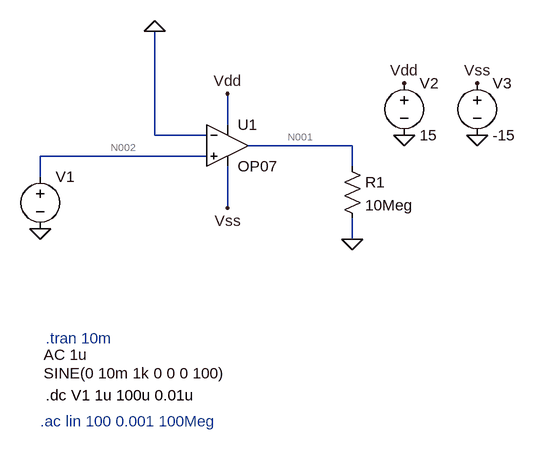
[diagram p0: schematic 1c.asc]
1c.asc, the LTspice schematic file:
Version 4.1
SHEET 1 880 680
WIRE 160 112 160 64
WIRE 48 128 48 -32
WIRE 128 128 48 128
WIRE 352 144 192 144
WIRE 128 160 -128 160
WIRE 352 176 352 144
WIRE -128 192 -128 160
WIRE 160 240 160 176
WIRE 352 288 352 256
FLAG -128 272 0
FLAG 432 128 0
FLAG 544 128 0
FLAG 432 48 Vdd
FLAG 544 48 Vss
FLAG 160 64 Vdd
FLAG 160 240 Vss
FLAG 352 288 0
FLAG 48 -32 0
SYMBOL voltage -128 176 R0
WINDOW 123 5 290 Left 2
WINDOW 39 0 0 Left 0
WINDOW 3 5 318 Left 2
SYMATTR Value2 AC 1u
SYMATTR InstName V1
SYMATTR Value SINE(0 10m 1k 0 0 0 100)
SYMBOL voltage 432 32 R0
SYMATTR InstName V2
SYMATTR Value 15
SYMBOL voltage 544 32 R0
SYMATTR InstName V3
SYMATTR Value -15
SYMBOL OpAmps\\OP07 160 80 R0
SYMATTR InstName U1
SYMBOL res 336 160 R0
SYMATTR InstName R1
SYMATTR Value 10Meg
TEXT -128 568 Left 2 ;.ac lin 100 0.001 100Meg
TEXT -120 528 Left 2 !.dc V1 1u 100u 0.01u
TEXT -120 440 Left 2 ;.tran 10m

The netlist it stands for:
* 1c.asc
V1 N002 0 SINE(0 10m 1k 0 0 0 100) AC 1u
V2 Vdd 0 15
V3 Vss 0 -15
X§U1 N002 0 Vdd Vss N001 LT1001  ; OP07, pins In+ In- V+ V- OUT
R1 N001 0 10Meg
* .ac lin 100 0.001 100Meg
.dc V1 1u 100u 0.01u
* .tran 10m
.lib LTC.lib
.backanno
.end

* Results of the author's LTspice run, read from the files saved beside the schematic
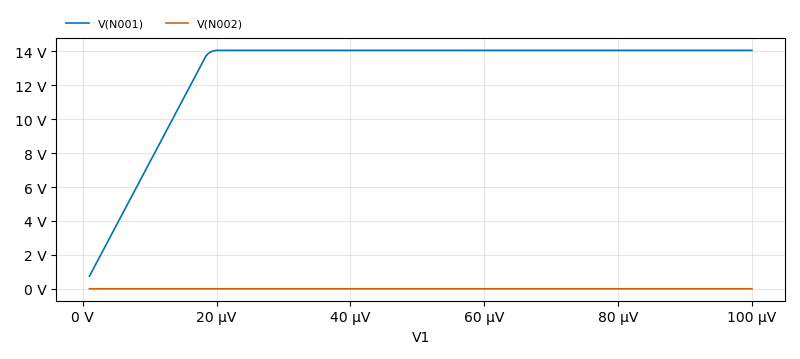
[diagram p1: DC transfer characteristic of 1c.asc, plotted from the saved traces]
* DC transfer characteristic, 1 run:
*   V(N001): 746.3 mV at V1=1 µV, 14.06 V at V1=100 µV, min 746.3 mV, max 14.06 V
*   V(N002): 1 µV at V1=1 µV, 100 µV at V1=100 µV, min 1 µV, max 100 µV